# EAGLE design Angin_Arus (EAGLE 7.6.0)
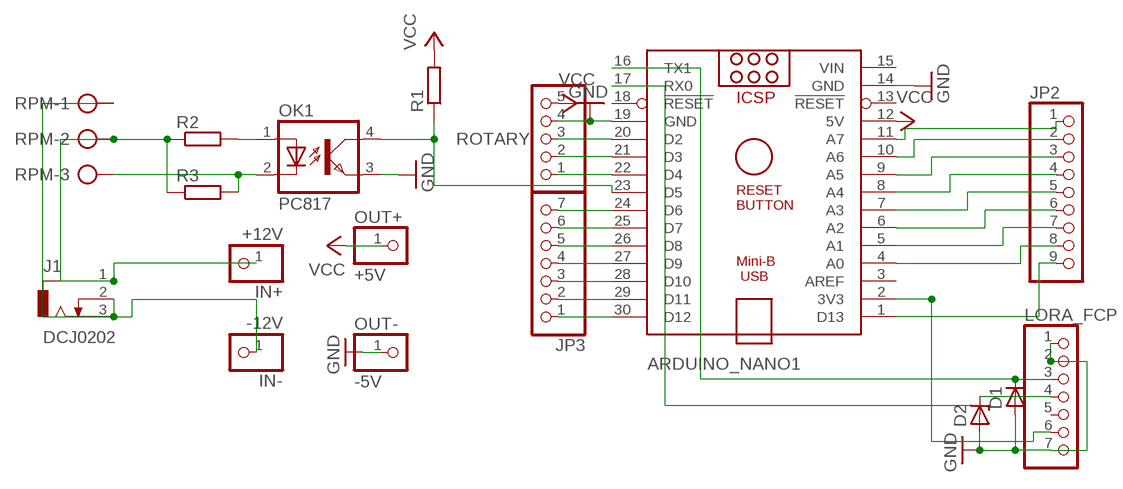
[diagram p0: schematic, sheet 1]

## Parts
ARDUINO_NANO1  ARDUINO_NANO  [ARDUINO_NANO]
D1  ZENER-DIODEDO35Z10  [DO35Z10]
D2  ZENER-DIODEDO35Z10  [DO35Z10]
IN+  +12V  PINHD-1X1  [1X01]
IN-  -12V  PINHD-1X1  [1X01]
J1  DCJ0202  [DCJ0202]
JP2  PINHD-1X9  [1X09]
JP3  PINHD-1X7  [1X07]
LORA_FCP  PINHD-1X7  [1X07]
OK1  PC817  [DIL04]
OUT+  +5V  PINHD-1X1  [1X01]
OUT-  -5V  PINHD-1X1  [1X01]
R1  R-EU_0204/7  [0204/7]
R2  R-EU_0204/7  [0204/7]
R3  R-EU_0204/7  [0204/7]
ROTARY  PINHD-1X5  [1X05]
RPM  AK300/3  [AK300/3]

## Nets
3.3V: ARDUINO_NANO1.2(3V3) LORA_FCP.6
12V: IN+.1 J1.1 R2.1 R3.1 RPM.2
GND: ARDUINO_NANO1.14(GND) ARDUINO_NANO1.19(GND) D1.A D2.A LORA_FCP.1 LORA_FCP.2 LORA_FCP.7 OK1.3(EMIT) OUT-.1 ROTARY.4
GND12V: IN-.1 J1.2 J1.3 RPM.1
N$1: ARDUINO_NANO1.23(D5) OK1.4(COL) R1.1
N$2: OK1.1(A) R2.2
N$3: D2.C LORA_FCP.4
N$4: ARDUINO_NANO1.20(D2) ROTARY.3
N$5: ARDUINO_NANO1.21(D3) ROTARY.2
N$6: ARDUINO_NANO1.22(D4) ROTARY.1
N$7: ARDUINO_NANO1.8(A4) JP2.4
N$9: ARDUINO_NANO1.1(D13) JP2.9
N$10: ARDUINO_NANO1.4(A0) JP2.8
N$11: ARDUINO_NANO1.5(A1) JP2.7
N$12: ARDUINO_NANO1.6(A2) JP2.6
N$13: ARDUINO_NANO1.7(A3) JP2.5
N$14: ARDUINO_NANO1.9(A5) JP2.3
N$15: ARDUINO_NANO1.10(A6) JP2.2
N$16: ARDUINO_NANO1.11(A7) JP2.1
N$18: ARDUINO_NANO1.30(D12) JP3.1
N$19: ARDUINO_NANO1.29(D11) JP3.2
N$20: ARDUINO_NANO1.28(D10) JP3.3
N$21: ARDUINO_NANO1.27(D9) JP3.4
N$22: ARDUINO_NANO1.26(D8) JP3.5
N$23: ARDUINO_NANO1.25(D7) JP3.6
N$24: ARDUINO_NANO1.24(D6) JP3.7
RX: ARDUINO_NANO1.16(TX1) D1.C LORA_FCP.3
SIGNAL: OK1.2(C) R3.2 RPM.3
TX: ARDUINO_NANO1.17(RX0)
VCC: ARDUINO_NANO1.12(5V) OUT+.1 R1.2 ROTARY.5
Unconnected: ARDUINO_NANO1.3(AREF) ARDUINO_NANO1.13(!RESET) ARDUINO_NANO1.18(!RESET) LORA_FCP.5

## Power pins joined to a net without a drawn wire
VIN: ARDUINO_NANO1.15(VIN)

## Library data of the parts
ARDUINO_NANO1 = ArduinoNanoV30:ARDUINO_NANO: Arduino Nano V3.0 Overview: The Arduino Nano is a small, complete, and breadboard-friendly board based on the ATmega328 (Arduino Nano 3.x) or ATmega168 (Arduino Nano 2.x). It has more or less the same functionality of the Arduino Duemilanove, but in a different package. It lacks only a DC power jack, and works with a Mini-B USB cable instead of a standard one. The Nano was designed and is being produced by Gravitech. Specifications: Microcontroller Atmel ATmega168 or ATmega328 Operating Voltage (logic level) 5 V Input Voltage (recommended) 7-12 V Input Voltage (limits) 6-20 V Digital I/O Pins 14 (of which 6 provide PWM output) Analog Input Pins 8 DC Current per I/O Pin 40 mA Flash Memory 16 KB (ATmega168) or 32 KB (ATmega328) of which 2 KB used by bootloader SRAM 1 KB (ATmega168) or 2 KB (ATmega328) EEPROM 512 bytes (ATmega168) or 1 KB (ATmega328) Clock Speed 16 MHz Dimensions 0.73" x 1.70" Length 45 mm Width 18 mm Weigth 5 g Power: The Arduino Nano can be powered via the Mini-B USB connection, 6-20V unregulated external power supply (pin 30), or 5V regulated external power supply (pin 27). The power source is automatically selected to the highest voltage source. Memory: The ATmega168 has 16 KB of flash memory for storing code (of which 2 KB is used for the bootloader); the ATmega328 has 32 KB, (also with 2 KB used for the bootloader). The ATmega168 has 1 KB of SRAM and 512 bytes of EEPROM (which can be read and written with the EEPROM library); the ATmega328 has 2 KB of SRAM and 1 KB of EEPROM. Input and Output: Each of the 14 digital pins on the Nano can be used as an input or output, using pinMode(), digitalWrite(), and digitalRead() functions. They operate at 5 volts. Each pin can provide or receive a maximum of 40 mA and has an internal pull-up resistor (disconnected by default) of 20-50 kOhms. In addition, some pins have specialized functions. Visit Arduino - ArduinoBoardNano <https://www.arduino.cc/en/Main/ArduinoBoardNano>
D1 D2 = diode:ZENER-DIODE: Z-Diode
IN+ IN- OUT+ OUT- = pinhead:PINHD-1X1: PIN HEADER
J1 = con-jack:DCJ0202: DC POWER JACK Source: DCJ0202.pdf; OC_FARNELL: unknown; OC_NEWARK: unknown
JP2 = pinhead:PINHD-1X9: PIN HEADER
JP3 LORA_FCP = pinhead:PINHD-1X7: PIN HEADER
OK1 = optocoupler:PC817: SHARP OPTO COUPLER; MPN: PC817X4J000F; OC_FARNELL: 9707727; OC_NEWARK: 97K7059
R1-R3 = rcl:R-EU_: RESISTOR, European symbol
ROTARY = pinhead:PINHD-1X5: PIN HEADER
RPM = con-ptr500:AK300/3: CONNECTOR; OC_FARNELL: unknown; OC_NEWARK: unknown

## Board
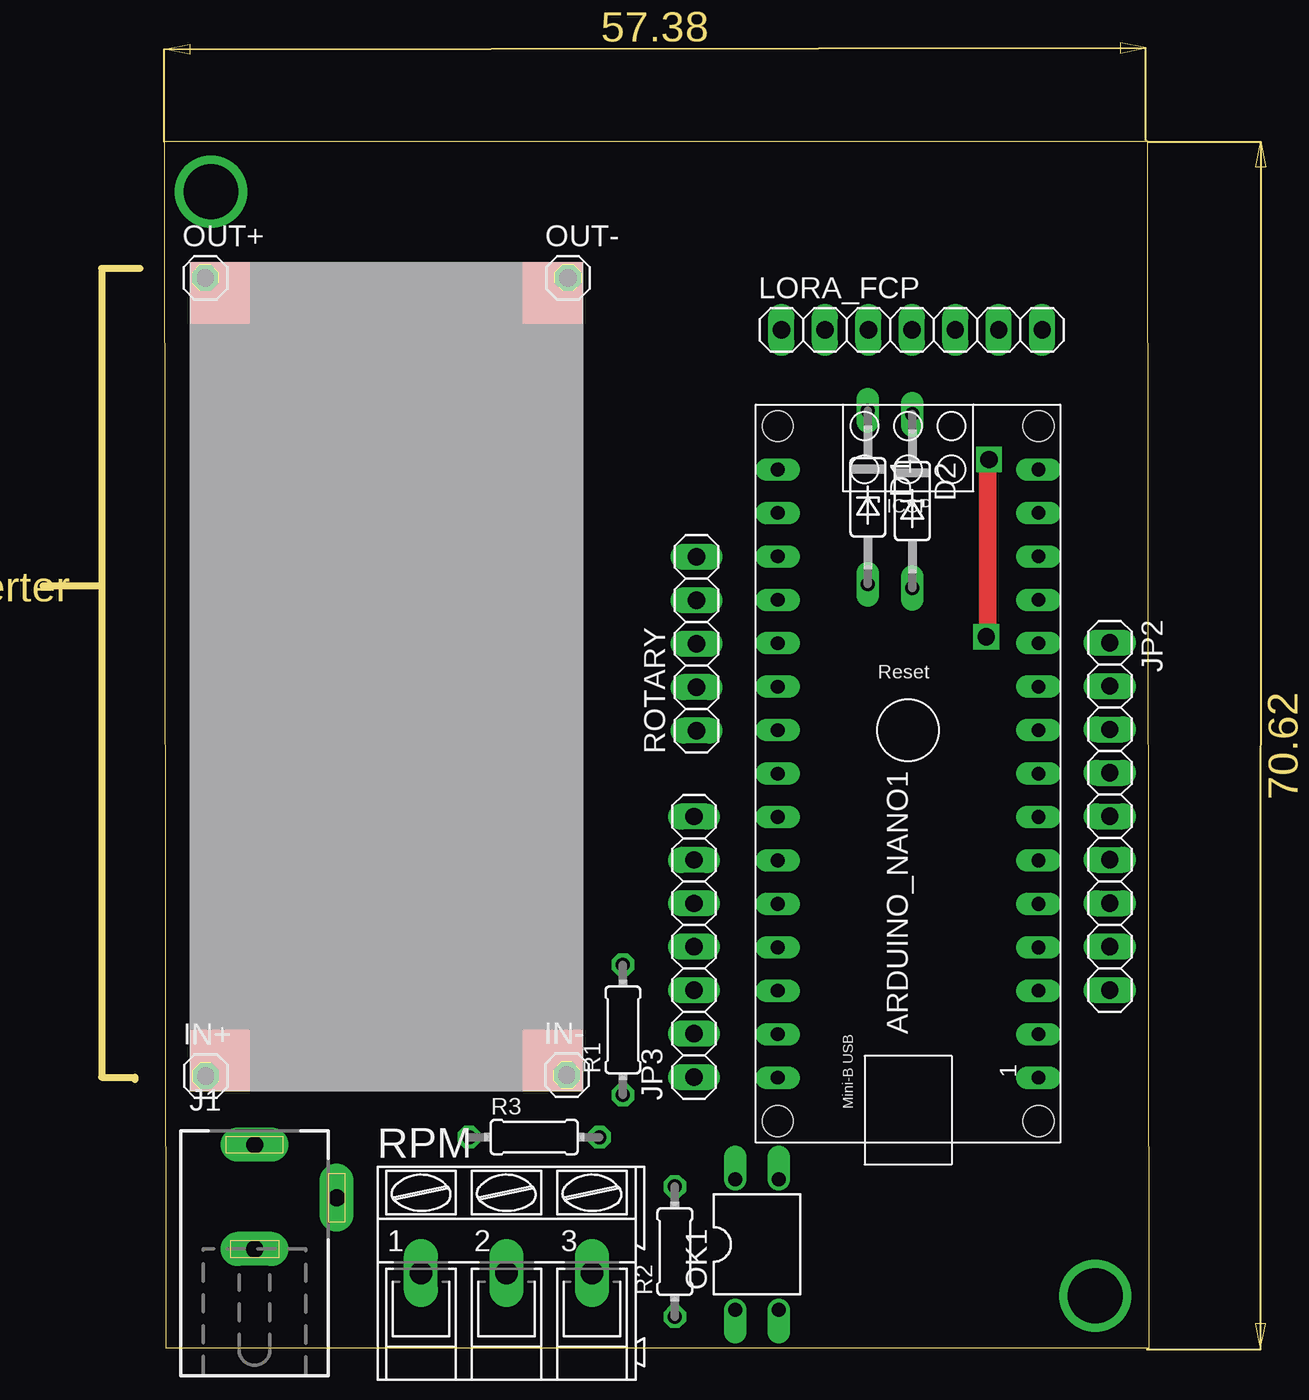
[diagram p1: board, top side]
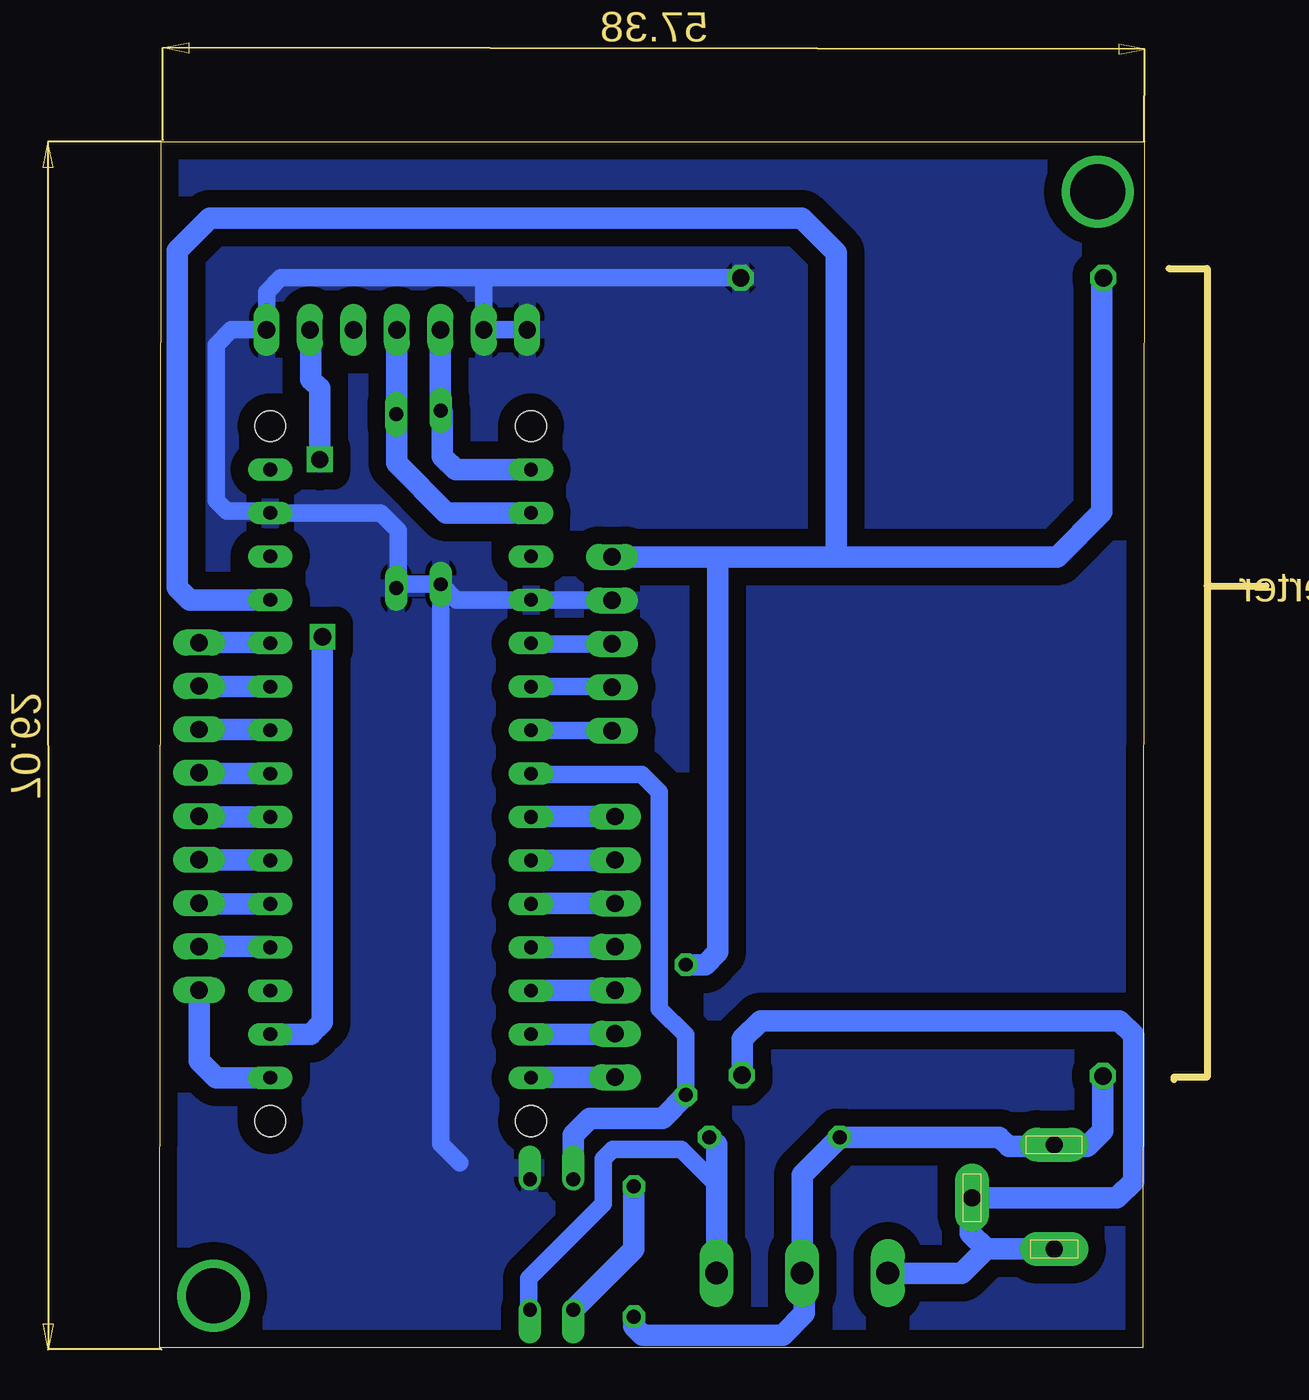
[diagram p2: board, bottom side, seen from below]

Size 64.67 x 70.53 mm. Coordinates in mm from the lower left corner, seen from the top.
Outline: 5.68,63.11 3.44,63.11 3.44,44.56
Outline: 3.44,44.56 3.44,15.83 5.38,15.83 5.38,15.68
Outline: 3.44,44.56 0,44.56
Outline: 7.19,0 64.67,0 64.58,70.53 7.1,70.53 7.19,0
Copper layers (1*16): Top 0.035mm / dielectric 1.5mm / Bottom 0.035mm
Design rules "default": minimum track width 10mil, minimum drill 24mil, track to track 8mil, track to pad 8mil, pad to pad 8mil, via to via 8mil, smd to smd 8mil, copper to edge 40mil, drill to drill 8mil, minimum pad ring 10mil, minimum via ring 8mil, stop-mask expansion 4mil, vias tented up to drill 0mil, thermal gap 10mil

### Footprints (pad centres in the part's own frame; a part is rotated, then mirrored left to right if it is on the bottom)
ARDUINO_NANO = drill 0.8 long: 1 -20.32,-7.62; 2 -17.78,-7.62; 3 -15.24,-7.62; 4 -12.7,-7.62; 5 -10.16,-7.62; 6 -7.62,-7.62; 7 -5.08,-7.62; 8 -2.54,-7.62; 9 0,-7.62; 10 2.54,-7.62; 11 5.08,-7.62; 12 7.62,-7.62; 13 10.16,-7.62; 14 12.7,-7.62; 15 15.24,-7.62; 16 15.24,7.62; 17 12.7,7.62; 18 10.16,7.62; 19 7.62,7.62; 20 5.08,7.62; 21 2.54,7.62; 22 0,7.62; 23 -2.54,7.62; 24 -5.08,7.62; 25 -7.62,7.62; 26 -10.16,7.62; 27 -12.7,7.62; 28 -15.24,7.62; 29 -17.78,7.62; 30 -20.32,7.62 | hole 1.778: -22.86,-7.62; -22.86,7.62; 17.78,7.62; 17.78,-7.62
DO35Z10 = drill 0.813 long: A 5.08,0; C -5.08,0
1X01 = drill 1.016 octagon: 1 0,0
DCJ0202 = drill 1 pad 2 long: 1 0,3.1; 2 4.8,0; 3 0,-3
1X09 = drill 1.016 long: 1 -10.16,0; 2 -7.62,0; 3 -5.08,0; 4 -2.54,0; 5 0,0; 6 2.54,0; 7 5.08,0; 8 7.62,0; 9 10.16,0
1X07 = drill 1.016 long: 1 -7.62,0; 2 -5.08,0; 3 -2.54,0; 4 0,0; 5 2.54,0; 6 5.08,0; 7 7.62,0
DIL04 = drill 0.813 offset: 1 -1.27,-3.81; 2 1.27,-3.81; 3 1.27,3.81; 4 -1.27,3.81
0204/7 = drill 0.813 octagon: 1 -3.81,0; 2 3.81,0
1X05 = drill 1.016 long: 1 -5.08,0; 2 -2.54,0; 3 0,0; 4 2.54,0; 5 5.08,0
AK300/3 = drill 1.321 long: 1 -5.004,0; 2 0,0; 3 5.004,0

### Placement (x,y rotation side)
ARDUINO_NANO1  50.58,36.12 90 top
D1  48.23,49.73 270 top
D2  50.83,49.51 270 top
IN+  9.53,15.9 0 top
IN-  30.63,15.95 0 top
J1  12.38,8.78 0 top
JP2  62.37,31.08 270 top
JP3  38.06,23.45 90 top
LORA_FCP  50.8,59.53 0 top
OK1  41.75,6.04 0 top
OUT+  9.5,62.57 0 top
OUT-  30.7,62.57 0 top
R1  33.91,18.59 90 top
R2  36.95,5.63 90 top
R3  28.73,12.32 0 top
ROTARY  38.22,41.17 90 top
RPM  27.11,4.37 0 top

### Tracks (layer width: path | path; a pad name or v marks a point on that pad's centre or on a via)
3.3V  (via drill 1)
  Top 1.016: v55.15,41.58 55.23,41.58 55.23,51.87 v55.31,51.95
  Bottom 1.016: v55.31,51.95 55.31,51.8 55.32,51.79 | 55.83,59.48 LORA_FCP.6
  Bottom 1.27: v55.15,41.58 55.15,19.02 55.47,18.7 55.83,18.34 ARDUINO_NANO1.2 | 55.32,51.79 55.32,56.12 55.83,56.63 55.83,59.48
12V
  Bottom 1.27: IN+.1 9.53,12.68 10.44,11.77 12.27,11.77 J1.1 12.49,11.77 15.03,11.77 15.58,12.32 R3.1 27.11,10.13 RPM.2 26.98,4.24 26.98,2.02 28.25,0.75 36.43,0.75 36.95,1.26 R2.1
GND
  Bottom 1.016: LORA_FCP.1 LORA_FCP.2 45.72,62.42 45.57,62.57 | D1.A 50.61,44.65 D2.A 50.71,44.55 50.71,47.78 51.75,48.82 ARDUINO_NANO1.14 58.3,48.92 60.74,48.92 61.37,49.55 61.37,58.63 60.47,59.53 LORA_FCP.7 58.42,61.74 57.59,62.57 45.57,62.57 | D1.A 48.23,11.92 47.12,10.81 | OUT-.1 45.57,62.57 | ROTARY.4 38.25,43.74 ARDUINO_NANO1.19 47.32,43.74 D1.A
  pour Bottom (isolate 1.016): 64.56,70.6 64.56,-0.09 7.31,-0.09 7.31,70.6
GND12V
  Bottom 1.27: IN-.1 30.6,15.98 30.6,18.07 29.54,19.13 8.57,19.13 7.74,18.3 7.74,9.75 8.71,8.78 J1.2 17.27,8.69 17.27,6.69 16.36,5.78 | J1.3 16.36,5.78 | RPM.1 17.77,4.37 16.36,5.78
N$1
  Bottom 1.016: R1.1 33.91,18.29 35.45,19.83 35.45,32.5 36.48,33.53 42.91,33.53 ARDUINO_NANO1.23
  Bottom 1.27: OK1.4 40.48,12.47 39.52,13.43 35.27,13.43 R1.1
N$2
  Bottom 1.27: R2.2 36.95,5.77 OK1.1
N$3
  Bottom 1.016: 50.8,54.62 D2.C
  Bottom 1.27: LORA_FCP.4 50.8,54.62
N$4
  Bottom 1.016: ROTARY.3 42.93,41.17 ARDUINO_NANO1.20
N$5
  Bottom 1.016: ARDUINO_NANO1.21 38.25,38.66 ROTARY.2
N$6
  Bottom 1.016: ROTARY.1 42.93,36.09 ARDUINO_NANO1.22
N$7
  Bottom 1.27: ARDUINO_NANO1.8 62.33,33.58 JP2.4
N$8  (via drill 3.2)
  other vias: 9.83,67.6
N$9
  Bottom 1.27: ARDUINO_NANO1.1 61.36,15.8 62.34,16.78 62.34,20.89 JP2.9
N$10
  Bottom 1.27: JP2.8 58.24,23.46 ARDUINO_NANO1.4
N$11
  Bottom 1.27: ARDUINO_NANO1.5 62.33,25.96 JP2.7
N$12
  Bottom 1.27: JP2.6 58.24,28.54 ARDUINO_NANO1.6
N$13
  Bottom 1.27: ARDUINO_NANO1.7 62.33,31.04 JP2.5
N$14
  Bottom 1.27: JP2.3 58.24,36.16 ARDUINO_NANO1.9
N$15
  Bottom 1.27: ARDUINO_NANO1.10 62.33,38.66 JP2.2
N$16
  Bottom 1.27: JP2.1 58.24,41.24 ARDUINO_NANO1.11
N$18
  Bottom 1.016: 42.93,15.83 ARDUINO_NANO1.30
  Bottom 1.27: JP3.1 42.93,15.83
N$19
  Bottom 1.016: 38.09,18.34 JP3.2
  Bottom 1.27: ARDUINO_NANO1.29 38.09,18.34
N$20
  Bottom 1.016: 42.93,20.91 ARDUINO_NANO1.28
  Bottom 1.27: JP3.3 42.93,20.91
N$21
  Bottom 1.016: 38.09,23.42 JP3.4
  Bottom 1.27: ARDUINO_NANO1.27 38.09,23.42
N$22
  Bottom 1.016: 42.93,25.99 ARDUINO_NANO1.26
  Bottom 1.27: JP3.5 42.93,25.99
N$23
  Bottom 1.016: 38.09,28.5 JP3.6
  Bottom 1.27: ARDUINO_NANO1.25 38.09,28.5
N$24
  Bottom 1.016: 42.93,31.07 ARDUINO_NANO1.24
  Bottom 1.27: JP3.7 42.93,31.07
N$25
  pour Bottom (isolate 1.016): 7.19,-0.21 7.19,70.62 64.48,70.62 64.48,65.62 24.58,65.62 24.58,65.48 24.98,65.48 24.98,45.49 32.36,45.49 32.36,17.67 32.47,17.67 32.47,-0.39
N$26  (via drill 3.2)
  other vias: 61.52,3.05
RX
  Bottom 1.016: 48.14,54.72 D1.C 48.26,54.84
  Bottom 1.27: ARDUINO_NANO1.16 47.37,51.36 48.14,52.13 48.14,54.72 | LORA_FCP.3 48.26,54.84
SIGNAL
  Bottom 1.016: 32.57,12.35 R3.2 | RPM.3 32.11,9.52 34.19,11.6 38.18,11.6 38.74,11.04 38.74,8.42 43.09,4.07 43.09,2.3 OK1.2
  Bottom 1.27: RPM.3 32.11,11.89 R3.2
TX
  Bottom 1.27: ARDUINO_NANO1.17 47.91,48.82 50.82,51.73 50.82,54.58
VCC
  Bottom 1.016: 9.59,62.48 OUT+.1 | 25.11,46.52 25.38,46.25
  Bottom 1.27: ROTARY.5 31.9,46.25 | 31.9,46.25 25.38,46.25 12.2,46.25 9.59,48.86 9.59,62.48 | 25.11,46.52 25.11,64.04 27.12,66.05 61.75,66.05 63.63,64.17 63.63,44.46 62.91,43.74 ARDUINO_NANO1.12 | R1.2 32.78,22.4 32.03,23.16 32.03,46.12 31.9,46.25
(copper drawn outside any net)
  shapes: Top area x4

### Text on the board
Dimension: XL6019 Buck Boost DC Converter